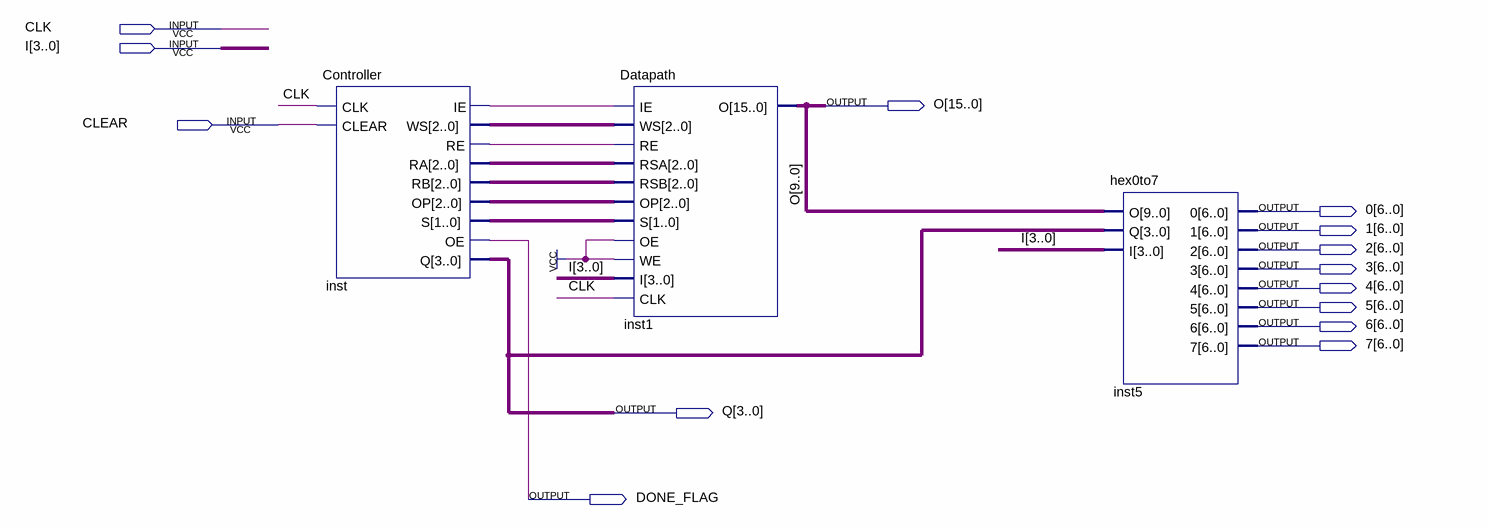
[diagram p0: schematic sheet]
// Quartus schematic FINAL_DESIGN.bdf as structural Verilog: 3 symbols, 14 pins
module FINAL_DESIGN (
  input  CLK,
  input  [3:0] I,
  input  CLEAR,
  output [15:0] O,
  output [6:0] \0 ,
  output [6:0] \1 ,
  output [6:0] \2 ,
  output [6:0] \3 ,
  output [6:0] \4 ,
  output [6:0] \5 ,
  output [6:0] \6 ,
  output [6:0] \7 ,
  output [3:0] Q,
  output DONE_FLAG
);

  wire inst_ie, inst_re;
  wire [1:0] inst_s;
  wire [2:0] inst_op, inst_ra, inst_rb, inst_ws;

  Controller inst (
    .CLK(CLK), .CLEAR(CLEAR), .IE(inst_ie), .WS(inst_ws), .RE(inst_re), .RA(inst_ra), .RB(inst_rb),
    .OP(inst_op), .S(inst_s), .OE(DONE_FLAG), .Q(Q));
  Datapath inst1 (
    .OE(1'b1), .S(inst_s), .OP(inst_op), .IE(inst_ie), .I(I), .WE(1'b1), .WS(inst_ws), .RE(inst_re),
    .RSA(inst_ra), .RSB(inst_rb), .CLK(CLK), .O(O));
  hex0to7 inst5 (
    .O(O[9:0]), .Q(Q), .I(I), .\0 (\0 ), .\1 (\1 ), .\2 (\2 ), .\3 (\3 ), .\4 (\4 ), .\5 (\5 ), .\6 (\6 ),
    .\7 (\7 ));
endmodule
